# Altium schematic sheet sb-sonata-hyperram.SchDoc: Hyperram
size Letter; Organization: NewAE Technology Inc.; Address1: 1083 Queen St., Suite 196; Address2: Halifax; Address3: NS; Address4: Canada B3H 0B2; SheetNumber: 19; SheetTotal: 20; SheetApproved: YES
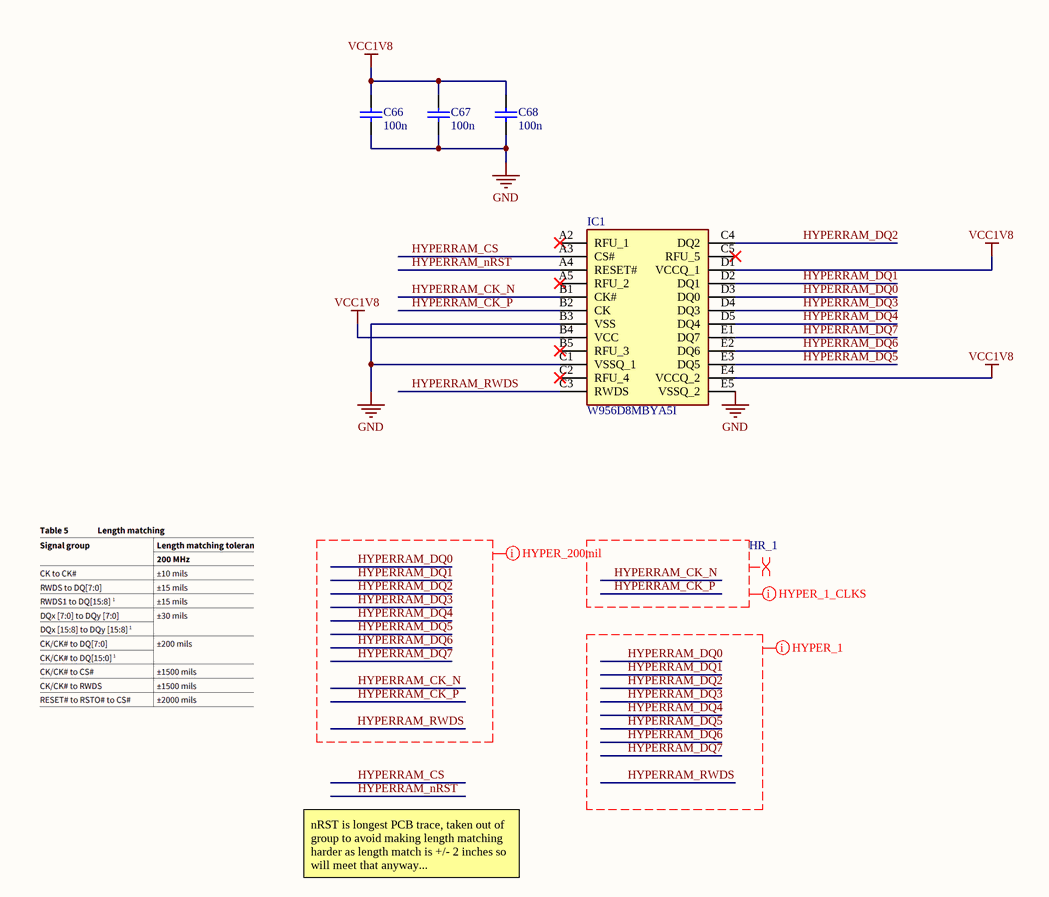
[diagram p0: sb-sonata-hyperram.SchDoc]

## Parts
C66  100n  [CAPC0402_M]
C67  100n  [CAPC0402_M]
C68  100n  [CAPC0402_M]
IC1  W956D8MBYA5I  [BGA24C100P5X5_600X800X120]

## Nets
GND: C66.2 C67.2 C68.2 IC1.B3(VSS) IC1.C1(VSSQ_1) IC1.E5(VSSQ_2)
VCC1V8: C66.1 C67.1 C68.1 IC1.B4(VCC) IC1.D1(VCCQ_1) IC1.E4(VCCQ_2)
HYPERRAM_CK_N: IC1.B1(CK#)
HYPERRAM_CK_P: IC1.B2(CK)
HYPERRAM_CS: IC1.A3(CS#)
HYPERRAM_DQ0: IC1.D3(DQ0)
HYPERRAM_DQ1: IC1.D2(DQ1)
HYPERRAM_DQ2: IC1.C4(DQ2)
HYPERRAM_DQ3: IC1.D4(DQ3)
HYPERRAM_DQ4: IC1.D5(DQ4)
HYPERRAM_DQ5: IC1.E3(DQ5)
HYPERRAM_DQ6: IC1.E2(DQ6)
HYPERRAM_DQ7: IC1.E1(DQ7)
HYPERRAM_nRST: IC1.A4(RESET#)
HYPERRAM_RWDS: IC1.C3(RWDS)

Not connected (* = marked no-connect by the designer): IC1 A2(RFU_1)* A5(RFU_2)* B5(RFU_3)* C2(RFU_4)* C5(RFU_5)*

## Layout directives
net class HYPER_200mil_Length: HYPERRAM_CK_N, HYPERRAM_CK_P, HYPERRAM_DQ0, HYPERRAM_DQ1, HYPERRAM_DQ2, HYPERRAM_DQ3, HYPERRAM_DQ4, HYPERRAM_DQ5, HYPERRAM_DQ6, HYPERRAM_DQ7, HYPERRAM_RWDS
differential pair; differential pair class HR_1: HYPERRAM_CK_N, HYPERRAM_CK_P
net class HYPER_1_Clks: HYPERRAM_CK_N, HYPERRAM_CK_P
net class HYPER_1_Length: HYPERRAM_DQ0, HYPERRAM_DQ1, HYPERRAM_DQ2, HYPERRAM_DQ3, HYPERRAM_DQ4, HYPERRAM_DQ5, HYPERRAM_DQ6, HYPERRAM_DQ7, HYPERRAM_RWDS

## Notes on the sheet
- nRST is longest PCB trace, taken out of group to avoid making length matching harder as length match is +/- 2 inches so will meet that anyway...
- Title:
- Date:
- Rev:
- Time:
- Project:
- Sheet
- of
- License:
- Copyright © NewAE Technology Inc.
- Approved:
- NewAE.com
- File:

## Library data of the parts
C66-C68 = CCHIP-100n-0402: 100n, 0402; Manufacture Part Number 1: CGA2B3X7R1V104K050BB; Component Group: Capacitor; Case-EIA: 0402; Part Number: CCHIP-100n-0402; Footprint: 0402; Pin Count: 2; Value: 100n; Mounting Technology: SMT; Component Kind: Standard; Component Type: Standard; Supplier 1: Digi-Key; Supplier Part Number 1: 445-6901-1-ND
IC1 = W956D8MBYA5I: Integrated Circuit; Manufacturer_Name: Winbond; Datasheet Link: https://www.winbond.com/hq/search-resource-file.jsp?partNo=W956D8MBYA5I&type=datasheet; Height: 1.2mm; Manufacturer_Part_Number: W956D8MBYA5I; Mouser Part Number: 454-W956D8MBYA5I; Mouser Price/Stock: https://www.mouser.co.uk/ProductDetail/Winbond/W956D8MBYA5I?qs=YwPsRIUVAOcvNB%2FM4WBgTQ%3D%3D